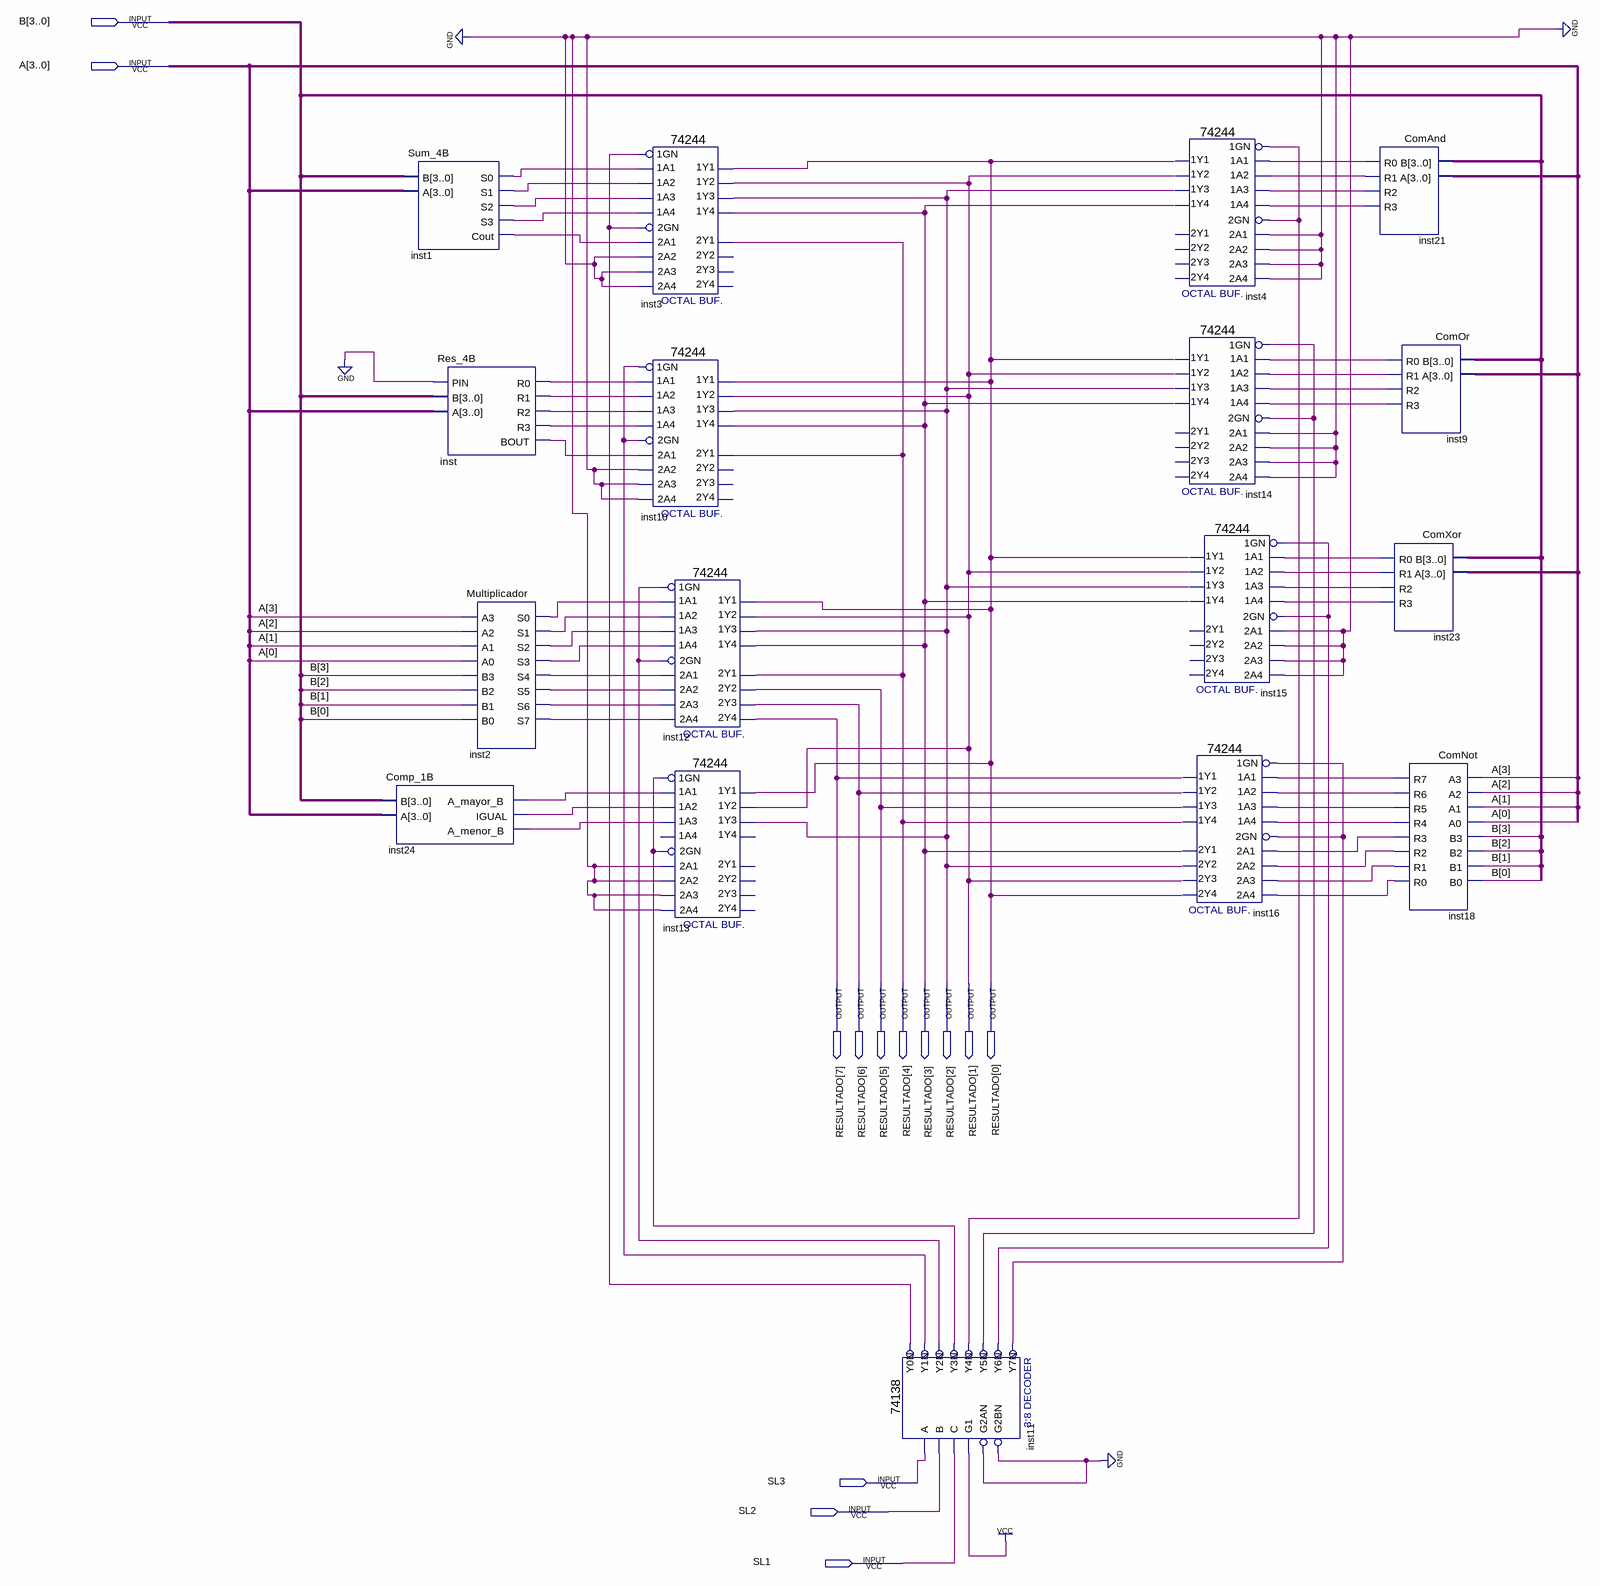
[diagram p0: schematic sheet]
// Quartus schematic Alu.bdf as structural Verilog: 17 symbols, 13 pins
module Alu (
  input  [3:0] B,
  input  [3:0] A,
  input  SL3,
  input  SL2,
  input  SL1,
  output [7:0] RESULTADO
);

  wire inst1_cout, inst1_s0, inst1_s1, inst1_s2, inst1_s3, inst2_s0, inst2_s1, inst2_s2, inst2_s3, inst2_s4,
       inst2_s5, inst2_s6, inst2_s7, inst9_r0, inst9_r1, inst9_r2, inst9_r3, inst11_y0n, inst11_y1n,
       inst11_y2n, inst11_y3n, inst11_y4n, inst11_y5n, inst11_y6n, inst11_y7n, inst18_r0, inst18_r1,
       inst18_r2, inst18_r3, inst18_r4, inst18_r5, inst18_r6, inst18_r7, inst21_r0, inst21_r1, inst21_r2,
       inst21_r3, inst23_r0, inst23_r1, inst23_r2, inst23_r3, inst24_a_mayor_b, inst24_a_menor_b,
       inst24_igual, inst_bout, inst_r0, inst_r1, inst_r2, inst_r3;

  Comp_1B inst24 (.B(B), .A(A), .A_mayor_B(inst24_a_mayor_b), .IGUAL(inst24_igual), .A_menor_B(inst24_a_menor_b));
  Sum_4B inst1 (.B(B), .A(A), .S0(inst1_s0), .S1(inst1_s1), .S2(inst1_s2), .S3(inst1_s3), .Cout(inst1_cout));
  Res_4B inst (.PIN(1'b0), .B(B), .A(A), .R0(inst_r0), .R1(inst_r1), .R2(inst_r2), .R3(inst_r3), .BOUT(inst_bout));
  Multiplicador inst2 (
    .A3(A[3]), .A2(A[2]), .A1(A[1]), .A0(A[0]), .B3(B[3]), .B2(B[2]), .B1(B[1]), .B0(B[0]), .S0(inst2_s0),
    .S1(inst2_s1), .S2(inst2_s2), .S3(inst2_s3), .S4(inst2_s4), .S5(inst2_s5), .S6(inst2_s6), .S7(inst2_s7));
  \74244  inst3 (
    .\1A2 (inst1_s1), .\1A4 (inst1_s3), .\1A1 (inst1_s0), .\1A3 (inst1_s2), .\1GN (inst11_y0n), .\2A3 (1'b0),
    .\2GN (inst11_y0n), .\2A1 (inst1_cout), .\2A4 (1'b0), .\2A2 (1'b0), .\1Y2 (RESULTADO[1]),
    .\1Y4 (RESULTADO[3]), .\2Y1 (RESULTADO[4]), .\1Y1 (RESULTADO[0]), .\1Y3 (RESULTADO[2]));  // open: 2Y3, 2Y4, 2Y2
  \74244  inst10 (
    .\1A2 (inst_r1), .\1A4 (inst_r3), .\1A1 (inst_r0), .\1A3 (inst_r2), .\1GN (inst11_y1n), .\2A3 (1'b0),
    .\2GN (inst11_y1n), .\2A1 (inst_bout), .\2A4 (1'b0), .\2A2 (1'b0), .\1Y2 (RESULTADO[1]),
    .\1Y4 (RESULTADO[3]), .\2Y1 (RESULTADO[4]), .\1Y1 (RESULTADO[0]), .\1Y3 (RESULTADO[2]));  // open: 2Y3, 2Y4, 2Y2
  \74244  inst12 (
    .\1A2 (inst2_s1), .\1A4 (inst2_s3), .\1A1 (inst2_s0), .\1A3 (inst2_s2), .\1GN (inst11_y2n),
    .\2A3 (inst2_s6), .\2GN (inst11_y2n), .\2A1 (inst2_s4), .\2A4 (inst2_s7), .\2A2 (inst2_s5),
    .\1Y2 (RESULTADO[1]), .\1Y4 (RESULTADO[3]), .\2Y1 (RESULTADO[4]), .\1Y1 (RESULTADO[0]),
    .\2Y3 (RESULTADO[6]), .\2Y4 (RESULTADO[7]), .\1Y3 (RESULTADO[2]), .\2Y2 (RESULTADO[5]));
  \74244  inst13 (
    .\1A2 (inst24_igual), .\1A1 (inst24_a_mayor_b), .\1A3 (inst24_a_menor_b), .\1GN (inst11_y3n),
    .\2A3 (1'b0), .\2GN (inst11_y3n), .\2A1 (1'b0), .\2A4 (1'b0), .\2A2 (1'b0), .\1Y2 (RESULTADO[1]),
    .\1Y1 (RESULTADO[0]), .\1Y3 (RESULTADO[2]));  // open: 1A4, 1Y4, 2Y1, 2Y3, 2Y4, 2Y2
  \74138  inst11 (
    .A(SL3), .B(SL2), .G1(1'b1), .C(SL1), .G2AN(1'b0), .G2BN(1'b0), .Y0N(inst11_y0n), .Y1N(inst11_y1n),
    .Y2N(inst11_y2n), .Y3N(inst11_y3n), .Y4N(inst11_y4n), .Y5N(inst11_y5n), .Y6N(inst11_y6n), .Y7N(inst11_y7n));
  \74244  inst4 (
    .\1A2 (inst21_r1), .\1A4 (inst21_r3), .\1A1 (inst21_r0), .\1A3 (inst21_r2), .\1GN (inst11_y4n),
    .\2A3 (1'b0), .\2GN (inst11_y4n), .\2A1 (1'b0), .\2A4 (1'b0), .\2A2 (1'b0), .\1Y2 (RESULTADO[1]),
    .\1Y4 (RESULTADO[3]), .\1Y1 (RESULTADO[0]), .\1Y3 (RESULTADO[2]));  // open: 2Y1, 2Y3, 2Y4, 2Y2
  \74244  inst14 (
    .\1A2 (inst9_r1), .\1A4 (inst9_r3), .\1A1 (inst9_r0), .\1A3 (inst9_r2), .\1GN (inst11_y5n), .\2A3 (1'b0),
    .\2GN (inst11_y5n), .\2A1 (1'b0), .\2A4 (1'b0), .\2A2 (1'b0), .\1Y2 (RESULTADO[1]), .\1Y4 (RESULTADO[3]),
    .\1Y1 (RESULTADO[0]), .\1Y3 (RESULTADO[2]));  // open: 2Y1, 2Y3, 2Y4, 2Y2
  \74244  inst15 (
    .\1A2 (inst23_r1), .\1A4 (inst23_r3), .\1A1 (inst23_r0), .\1A3 (inst23_r2), .\1GN (inst11_y6n),
    .\2A3 (1'b0), .\2GN (inst11_y6n), .\2A1 (1'b0), .\2A4 (1'b0), .\2A2 (1'b0), .\1Y2 (RESULTADO[1]),
    .\1Y4 (RESULTADO[3]), .\1Y1 (RESULTADO[0]), .\1Y3 (RESULTADO[2]));  // open: 2Y1, 2Y3, 2Y4, 2Y2
  \74244  inst16 (
    .\1A2 (inst18_r6), .\1A4 (inst18_r4), .\1A1 (inst18_r7), .\1A3 (inst18_r5), .\1GN (inst11_y7n),
    .\2A3 (inst18_r1), .\2GN (inst11_y7n), .\2A1 (inst18_r3), .\2A4 (inst18_r0), .\2A2 (inst18_r2),
    .\1Y2 (RESULTADO[6]), .\1Y4 (RESULTADO[4]), .\2Y1 (RESULTADO[3]), .\1Y1 (RESULTADO[7]),
    .\2Y3 (RESULTADO[1]), .\2Y4 (RESULTADO[0]), .\1Y3 (RESULTADO[5]), .\2Y2 (RESULTADO[2]));
  ComAnd inst21 (.B(B), .A(A), .R0(inst21_r0), .R1(inst21_r1), .R2(inst21_r2), .R3(inst21_r3));
  ComXor inst23 (.B(B), .A(A), .R0(inst23_r0), .R1(inst23_r1), .R2(inst23_r2), .R3(inst23_r3));
  ComOr inst9 (.B(B), .A(A), .R0(inst9_r0), .R1(inst9_r1), .R2(inst9_r2), .R3(inst9_r3));
  ComNot inst18 (
    .A3(A[3]), .A2(A[2]), .A1(A[1]), .A0(A[0]), .B3(B[3]), .B2(B[2]), .B1(B[1]), .B0(B[0]), .R7(inst18_r7),
    .R6(inst18_r6), .R5(inst18_r5), .R4(inst18_r4), .R3(inst18_r3), .R2(inst18_r2), .R1(inst18_r1),
    .R0(inst18_r0));
endmodule
